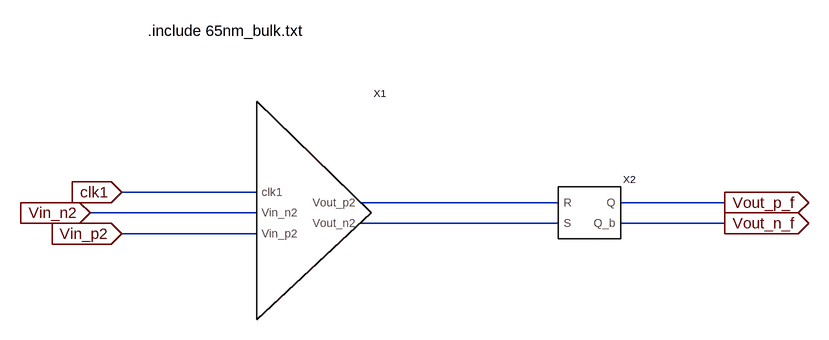
[diagram p0: schematic sub_comp.asc]
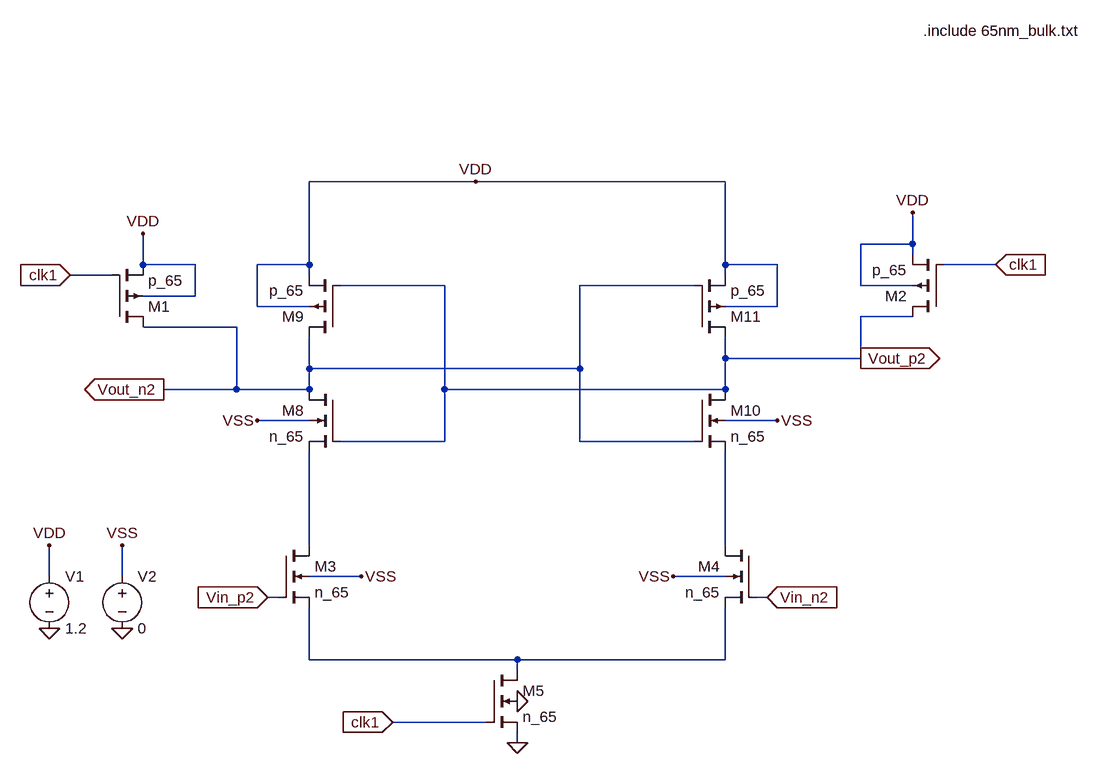
[diagram p1: sub-circuit dyn_comp.asc]
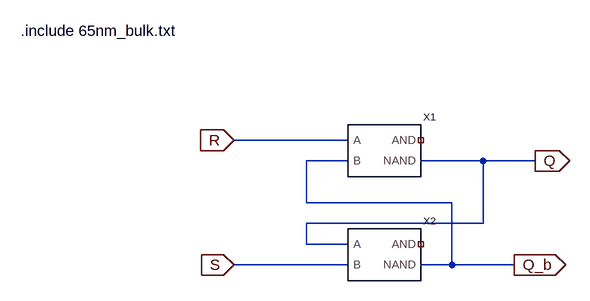
[diagram p2: sub-circuit nand_latch.asc]
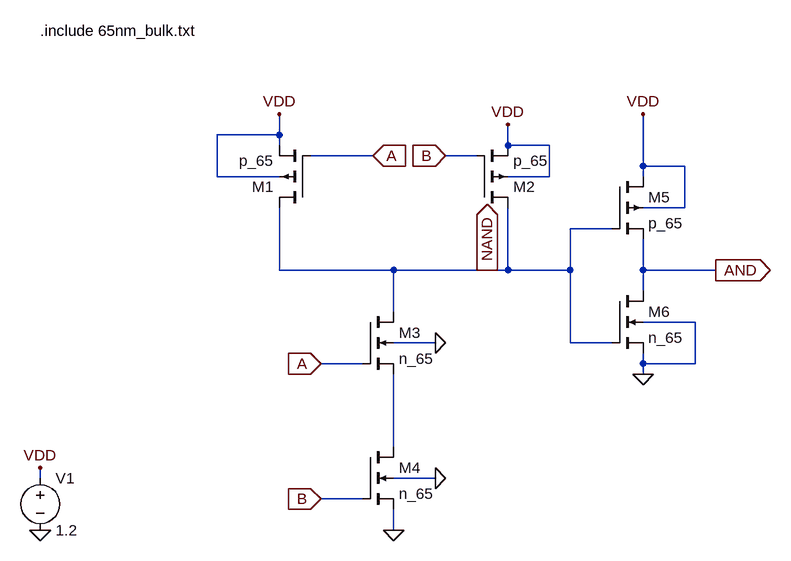
[diagram p3: sub-circuit nand.asc]
sub_comp.asc, the LTspice schematic file:
Version 4
SHEET 1 1112 680
WIRE 240 192 32 192
WIRE 704 208 400 208
WIRE 960 208 800 208
WIRE 240 224 -16 224
WIRE 704 240 400 240
WIRE 960 240 800 240
WIRE 240 256 32 256
FLAG 32 192 clk1
IOPIN 32 192 In
FLAG -16 224 Vin_n2
IOPIN -16 224 In
FLAG 32 256 Vin_p2
IOPIN 32 256 In
FLAG 960 208 Vout_p_f
IOPIN 960 208 Out
FLAG 960 240 Vout_n_f
IOPIN 960 240 Out
SYMBOL dyn_comp 336 224 R0
SYMATTR InstName X1
SYMBOL nand_latch 752 224 R0
SYMATTR InstName X2
TEXT 72 -56 Left 2 !.include 65nm_bulk.txt

dyn_comp.asc, the sub-circuit schematic file:
Version 4
SHEET 1 1516 1280
WIRE 400 -48 144 -48
WIRE 784 -48 400 -48
WIRE 1072 48 1072 0
WIRE 1072 48 992 48
WIRE 1072 64 1072 48
WIRE -112 80 -112 32
WIRE -32 80 -112 80
WIRE 144 80 144 -48
WIRE 144 80 64 80
WIRE 784 80 784 -48
WIRE 864 80 784 80
WIRE 1200 80 1120 80
WIRE -160 96 -224 96
WIRE 144 96 144 80
WIRE 784 96 784 80
WIRE 352 112 192 112
WIRE 736 112 560 112
WIRE 992 112 992 48
WIRE 1072 112 992 112
WIRE -32 128 -32 80
WIRE -32 128 -112 128
WIRE 64 144 64 80
WIRE 144 144 64 144
WIRE 864 144 864 80
WIRE 864 144 784 144
WIRE 1072 160 992 160
WIRE 32 176 -112 176
WIRE 784 224 784 192
WIRE 992 224 992 160
WIRE 992 224 784 224
WIRE 144 240 144 192
WIRE 560 240 560 112
WIRE 560 240 144 240
WIRE 32 272 32 176
WIRE 32 272 -80 272
WIRE 144 272 144 240
WIRE 144 272 32 272
WIRE 352 272 352 112
WIRE 784 272 784 224
WIRE 784 272 352 272
WIRE 144 320 64 320
WIRE 864 320 784 320
WIRE 352 352 352 272
WIRE 352 352 192 352
WIRE 560 352 560 240
WIRE 736 352 560 352
WIRE 144 512 144 368
WIRE 784 512 784 368
WIRE -256 560 -256 512
WIRE -144 560 -144 512
WIRE 224 560 144 560
WIRE 784 560 704 560
WIRE 96 592 80 592
WIRE 848 592 832 592
WIRE 144 688 144 608
WIRE 464 688 144 688
WIRE 784 688 784 608
WIRE 784 688 464 688
WIRE 464 704 464 688
WIRE 416 784 272 784
WIRE 464 816 464 800
FLAG -256 640 0
FLAG -256 512 VDD
FLAG -144 640 0
FLAG -144 512 VSS
FLAG -112 32 VDD
FLAG 1072 0 VDD
FLAG -224 96 clk1
IOPIN -224 96 In
FLAG 1200 80 clk1
IOPIN 1200 80 In
FLAG 272 784 clk1
IOPIN 272 784 In
FLAG 848 592 Vin_n2
IOPIN 848 592 In
FLAG 80 592 Vin_p2
IOPIN 80 592 In
FLAG 464 816 0
FLAG 704 560 VSS
FLAG 224 560 VSS
FLAG 464 752 0
FLAG 400 -48 VDD
FLAG 64 320 VSS
FLAG 864 320 VSS
FLAG -80 272 Vout_n2
IOPIN -80 272 Out
FLAG 992 224 Vout_p2
IOPIN 992 224 Out
SYMBOL Voltage -256 544 R0
SYMATTR InstName V1
SYMATTR Value 1.2
SYMBOL Voltage -144 544 R0
SYMATTR InstName V2
SYMATTR Value 0
SYMBOL pmos4 -160 176 M180
SYMATTR InstName M1
SYMATTR Value p_65
SYMATTR Value2 l=65n w=1u
SYMBOL pmos4 1120 160 R180
SYMATTR InstName M2
SYMATTR Value p_65
SYMATTR Value2 l=65n w=1u
SYMBOL nmos4 96 512 R0
SYMATTR InstName M3
SYMATTR Value n_65
SYMATTR Value2 l=0.1u w=10u
SYMBOL nmos4 832 512 M0
SYMATTR InstName M4
SYMATTR Value n_65
SYMATTR Value2 l=0.1u w=10u
SYMBOL nmos4 416 704 R0
SYMATTR InstName M5
SYMATTR Value n_65
SYMATTR Value2 l=1u w=20u
SYMBOL nmos4 192 272 M0
SYMATTR InstName M8
SYMATTR Value n_65
SYMATTR Value2 l=65n w=0.8u
SYMBOL pmos4 192 192 R180
SYMATTR InstName M9
SYMATTR Value p_65
SYMATTR Value2 l=65n w=1.6u
SYMBOL nmos4 736 272 R0
SYMATTR InstName M10
SYMATTR Value n_65
SYMATTR Value2 l=65n w=0.8u
SYMBOL pmos4 736 192 M180
SYMATTR InstName M11
SYMATTR Value p_65
SYMATTR Value2 l=65n w=1.6u
TEXT 1088 -280 Left 2 !.include 65nm_bulk.txt

nand_latch.asc, the sub-circuit schematic file:
Version 4
SHEET 1 880 680
WIRE 384 224 208 224
WIRE 384 256 320 256
WIRE 592 256 496 256
WIRE 672 256 592 256
WIRE 320 320 320 256
WIRE 544 320 320 320
WIRE 592 352 592 256
WIRE 592 352 320 352
WIRE 320 384 320 352
WIRE 384 384 320 384
WIRE 384 416 208 416
WIRE 544 416 544 320
WIRE 544 416 496 416
WIRE 640 416 544 416
FLAG 672 256 Q
IOPIN 672 256 Out
FLAG 640 416 Q_b
IOPIN 640 416 Out
FLAG 208 224 R
IOPIN 208 224 In
FLAG 208 416 S
IOPIN 208 416 In
SYMBOL nand 432 240 R0
SYMATTR InstName X1
SYMBOL nand 432 400 R0
SYMATTR InstName X2
TEXT -120 56 Left 2 !.include 65nm_bulk.txt

nand.asc, the sub-circuit schematic file:
Version 4
SHEET 1 1500 944
WIRE 560 224 560 192
WIRE 560 224 464 224
WIRE 560 240 560 224
WIRE 912 240 912 208
WIRE 976 240 912 240
WIRE 704 256 608 256
WIRE 864 256 816 256
WIRE 1120 272 1120 192
WIRE 1184 272 1120 272
WIRE 464 288 464 224
WIRE 560 288 464 288
WIRE 976 288 976 240
WIRE 976 288 912 288
WIRE 1120 288 1120 272
WIRE 1184 336 1184 272
WIRE 1184 336 1120 336
WIRE 1072 368 1008 368
WIRE 560 432 560 336
WIRE 736 432 560 432
WIRE 880 432 736 432
WIRE 912 432 912 336
WIRE 912 432 880 432
WIRE 1008 432 1008 368
WIRE 1008 432 912 432
WIRE 1120 432 1120 384
WIRE 1232 432 1120 432
WIRE 1120 464 1120 432
WIRE 736 496 736 432
WIRE 1200 512 1120 512
WIRE 800 544 736 544
WIRE 1008 544 1008 432
WIRE 1072 544 1008 544
WIRE 688 576 624 576
WIRE 1120 576 1120 560
WIRE 1200 576 1200 512
WIRE 1200 576 1120 576
WIRE 1120 592 1120 576
WIRE 736 704 736 592
WIRE 192 752 192 736
WIRE 800 752 736 752
WIRE 688 784 624 784
WIRE 736 832 736 800
FLAG 1232 432 AND
IOPIN 1232 432 Out
FLAG 192 832 0
FLAG 1120 592 0
FLAG 880 432 NAND
IOPIN 880 432 Out
FLAG 704 256 A
IOPIN 704 256 In
FLAG 816 256 B
IOPIN 816 256 In
FLAG 624 576 A
IOPIN 624 576 In
FLAG 624 784 B
IOPIN 624 784 In
FLAG 800 544 0
FLAG 800 752 0
FLAG 736 832 0
FLAG 192 736 VDD
FLAG 560 192 VDD
FLAG 912 208 VDD
FLAG 1120 192 VDD
SYMBOL pmos4 608 336 R180
SYMATTR InstName M1
SYMATTR Value p_65
SYMATTR Value2 l=65n w=2u
SYMBOL pmos4 864 336 M180
SYMATTR InstName M2
SYMATTR Value p_65
SYMATTR Value2 l=65n w=2u
SYMBOL nmos4 688 496 R0
SYMATTR InstName M3
SYMATTR Value n_65
SYMATTR Value2 l=65n w=1u
SYMBOL nmos4 688 704 R0
SYMATTR InstName M4
SYMATTR Value n_65
SYMATTR Value2 l=65n w=1u
SYMBOL pmos4 1072 288 R0
SYMATTR InstName M5
SYMATTR Value2 l=65n w=4u
SYMATTR Value p_65
SYMBOL nmos4 1072 464 R0
SYMATTR InstName M6
SYMATTR Value2 l=65n w=2u
SYMATTR Value n_65
SYMBOL Voltage 192 736 R0
SYMATTR InstName V1
SYMATTR Value 1.2
TEXT 192 64 Left 2 !.include 65nm_bulk.txt

The netlist it stands for:
* sub_comp.asc
XX1 clk1 Vin_n2 Vin_p2 N002 N001 dyn_comp
XX2 N001 N002 Vout_p_f Vout_n_f nand_latch

* block symbol definitions
.subckt dyn_comp clk1 Vin_n2 Vin_p2 Vout_n2 Vout_p2
V1 VDD 0 1.2
V2 VSS 0 0
M1 Vout_n2 clk1 VDD VDD p_65 l=65n w=1u
M2 Vout_p2 clk1 VDD VDD p_65 l=65n w=1u
M3 N001 Vin_p2 N003 VSS n_65 l=0.1u w=10u
M4 N002 Vin_n2 N003 VSS n_65 l=0.1u w=10u
M5 N003 clk1 0 0 n_65 l=1u w=20u
M8 Vout_n2 Vout_p2 N001 VSS n_65 l=65n w=0.8u
M9 Vout_n2 Vout_p2 VDD VDD p_65 l=65n w=1.6u
M10 Vout_p2 Vout_n2 N002 VSS n_65 l=65n w=0.8u
M11 Vout_p2 Vout_n2 VDD VDD p_65 l=65n w=1.6u
.include 65nm_bulk.txt
.ends dyn_comp

.subckt nand_latch R S Q Q_b
XX1 R Q_b NC_01 Q nand
XX2 Q S NC_02 Q_b nand
.include 65nm_bulk.txt
.ends nand_latch

.subckt nand A B AND NAND
M1 NAND A VDD VDD p_65 l=65n w=2u
M2 NAND B VDD VDD p_65 l=65n w=2u
M3 NAND A N001 0 n_65 l=65n w=1u
M4 N001 B 0 0 n_65 l=65n w=1u
M5 VDD NAND AND VDD p_65 l=65n w=4u
M6 AND NAND 0 0 n_65 l=65n w=2u
V1 VDD 0 1.2
.include 65nm_bulk.txt
.ends nand

.model NMOS NMOS
.model PMOS PMOS
.lib standard.mos
.include 65nm_bulk.txt
.backanno
.end